# EAGLE design medium_h222 (EAGLE 5.07)
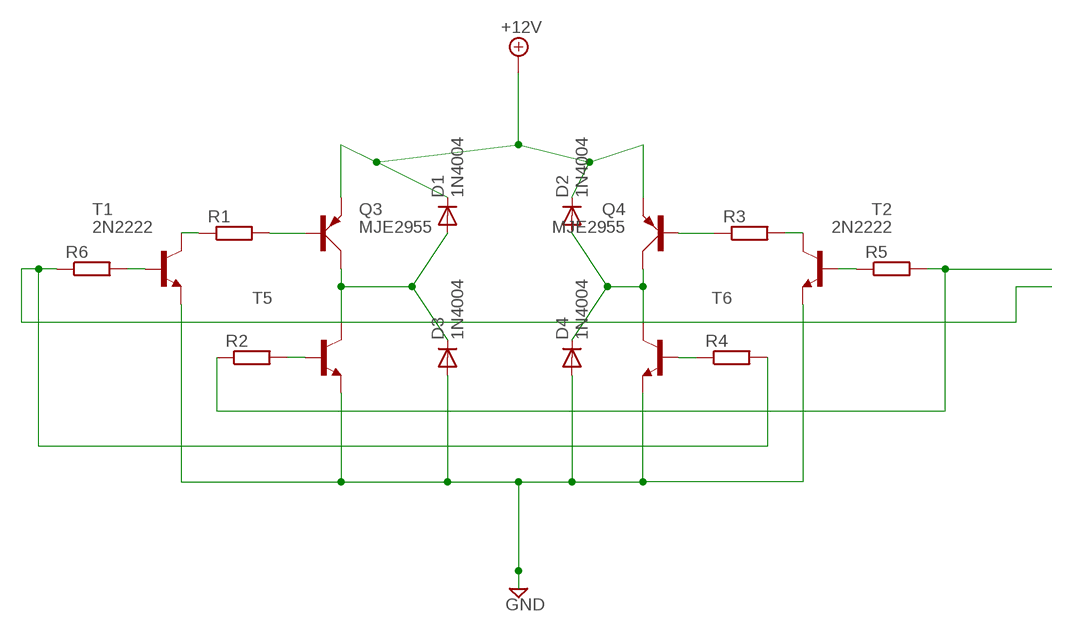
[diagram p0: schematic, sheet 1]

## Parts
D1  1N4004  [DO41-10]
D2  1N4004  [DO41-10]
D3  1N4004  [DO41-10]
D4  1N4004  [DO41-10]
Q3  MJE2955  [TO220AV]
Q4  MJE2955  [TO220AV]
R1  R-EU_0204/7  [0204/7]
R2  R-EU_0204/7  [0204/7]
R3  R-EU_0204/7  [0204/7]
R4  R-EU_0204/7  [0204/7]
R5  R-EU_0204/7  [0204/7]
R6  R-EU_0204/7  [0204/7]
T1  2N2222  [TO18]
T2  2N2222  [TO18]
T5  -NPN-TO220V  [TO220V]
T6  -NPN-TO220V  [TO220V]

## Nets
+12V: D1.C D2.C Q3.E Q4.E
GND: D3.A D4.A T1.1(E) T2.1(E) T5.3(E) T6.3(E)
N$1: R1.1 T1.3(C)
N$2: Q3.B R1.2
N$3: D2.A D4.C Q4.C T6.2(C)
N$6: R4.2 R6.1
N$7: R4.1 T6.1(B)
N$8: Q4.B R3.1
N$9: R2.2 T5.1(B)
N$10: R6.2 T1.2(B)
N$11: R5.1 T2.2(B)
N$12: R3.2 T2.3(C)
N$13: D1.A D3.C Q3.C T5.2(C)
N$15: R2.1 R5.2

## Library data of the parts
D1-D4 = diode:1N4004: DIODE general purpose rectifier, 1 A
Q3 Q4 = transistor-power:MJE2955: PNP TRANSISTOR
R1-R6 = resistor:R-EU_: RESISTOR, European symbol
T1 T2 = transistor:2N2222: NPN TRANSISTOR
T5 T6 = transistor-neu-to92:*-NPN-: NPN Transistror

## Board
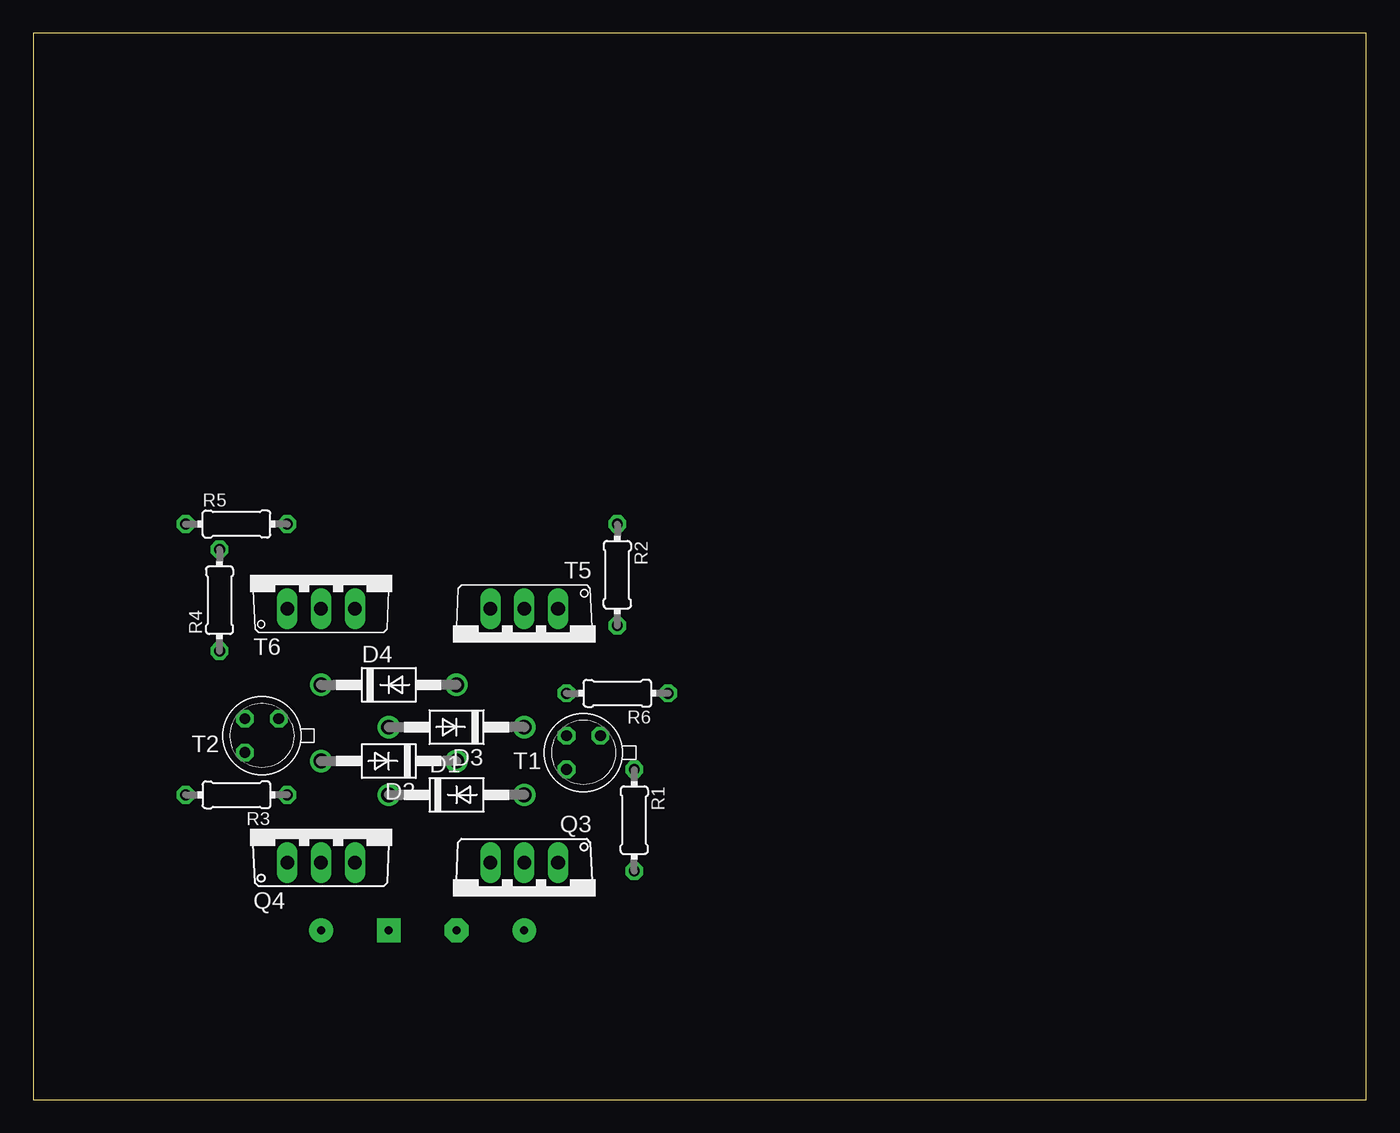
[diagram p1: board, top side]
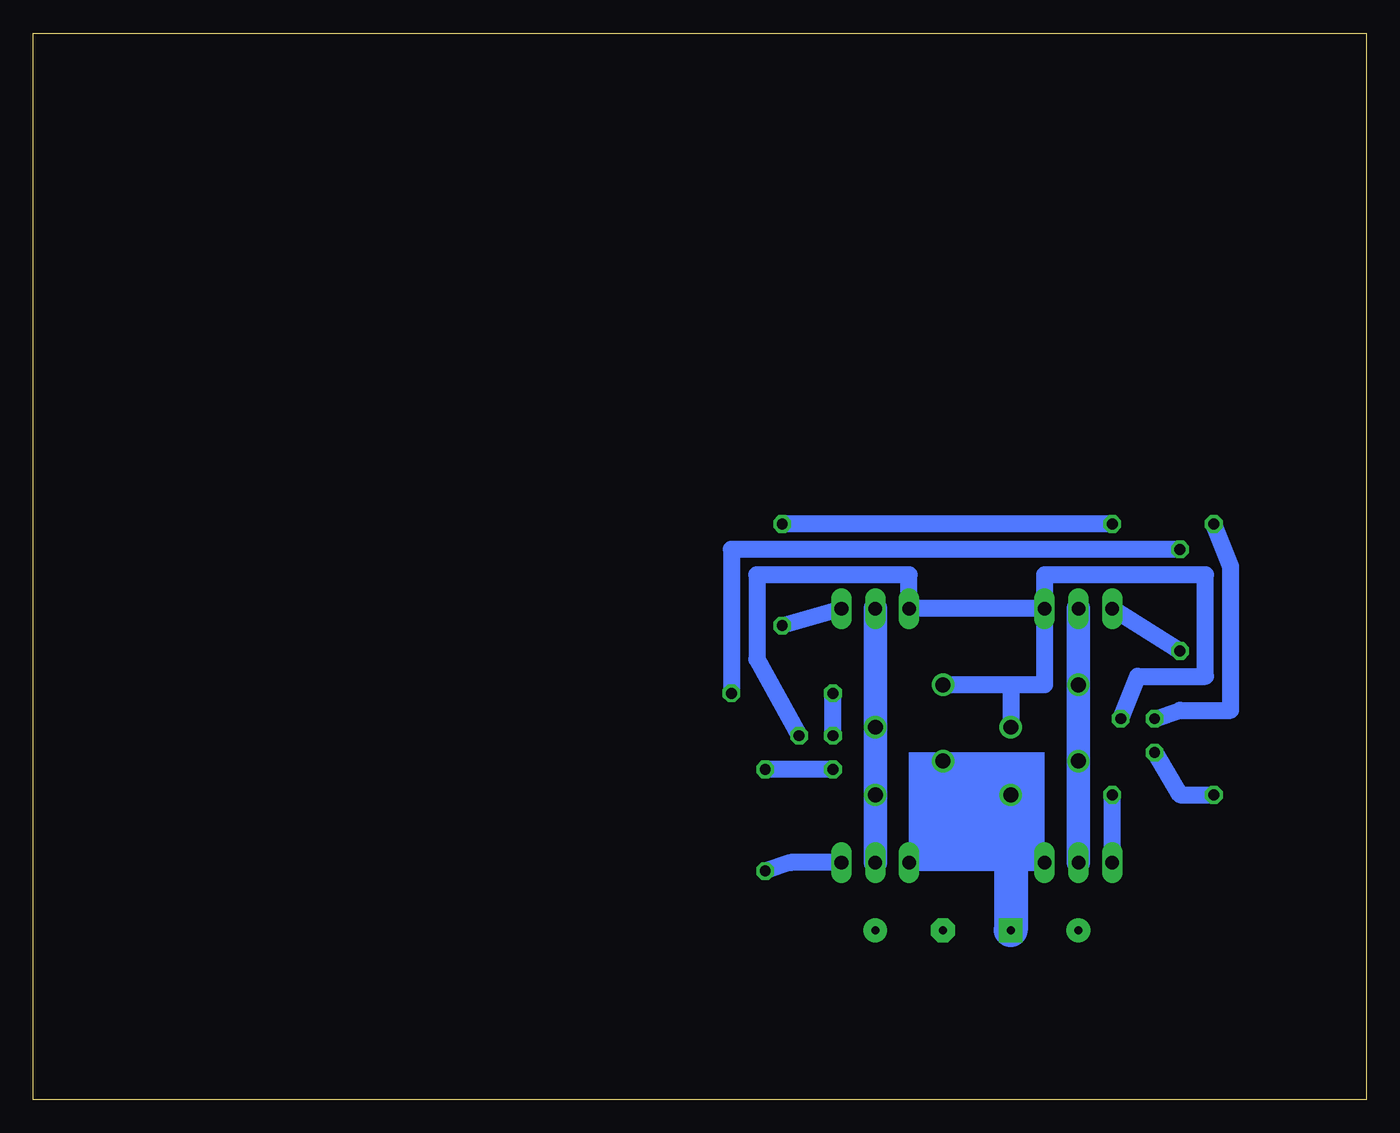
[diagram p2: board, bottom side, seen from below]

Size 100 x 80 mm. Coordinates in mm from the lower left corner, seen from the top.
Outline: 0,0 100,0 100,80 0,80 0,0
Copper layers (1*16): Top 0.035mm / dielectric 1.5mm / Bottom 0.035mm
Design rules "default": minimum track width 10mil, minimum drill 24mil, track to track 8mil, track to pad 8mil, pad to pad 8mil, via to via 8mil, smd to smd 8mil, copper to edge 40mil, drill to drill 8mil, minimum pad ring 10mil, minimum via ring 8mil, stop-mask expansion 4mil, vias tented up to drill 0mil, thermal gap 10mil

### Footprints (pad centres in the part's own frame; a part is rotated, then mirrored left to right if it is on the bottom)
DO41-10 = drill 1.118 round: A 5.08,0; C -5.08,0
TO220AV = drill 1.016 long: B -2.54,-2.54; C 0,-2.54; E 2.54,-2.54
0204/7 = drill 0.813 octagon: 1 -3.81,0; 2 3.81,0
TO18 = drill 0.813 octagon: 1 -1.27,-1.27; 2 1.27,-1.27; 3 1.27,1.27
TO220V = drill 1.016 long: 1 -2.54,-2.54; 2 0,-2.54; 3 2.54,-2.54

### Placement (x,y rotation side)
D1  31.75,22.86 0 top
D2  26.67,25.4 180 top
D3  31.75,27.94 180 top
D4  26.67,31.11 0 top
Q3  36.83,15.24 180 top
Q4  21.59,20.32 0 top
R1  45.09,20.95 270 top
R2  43.81,39.37 270 top
R3  15.24,22.86 180 top
R4  13.97,37.47 90 top
R5  15.24,43.18 0 top
R6  43.81,30.48 180 top
T1  41.27,26.04 180 top
T2  17.14,27.3 180 top
T5  36.83,34.29 180 top
T6  21.59,39.37 0 top

### Tracks (layer width: path | path; a pad name or v marks a point on that pad's centre or on a via)
+12V  (via drill 0.6 pad 1.78)
  Bottom 1.27: 27.94,17.78 Q3.E | Q4.E 26.67,17.78 27.94,17.78 | 27.94,17.78 D1.C D2.C
  Bottom 2.54: 26.67,17.78 v26.67,12.7
GND
  Bottom 1.27: T1.1 45.72,33.02 45.72,39.37 34.29,39.37 T5.3 T6.3 | T2.1 17.14,31.75 12.06,31.75 12.06,39.37 24.13,39.37 T6.3 | 26.67,31.11 D4.A | 26.67,31.11 24.13,31.11 T6.3 | 26.67,31.11 D3.A
N$1
  Bottom 1.27: T1.3 R1.1
N$2
  Bottom 1.27: Q3.B 43.18,17.78 R1.2
N$3
  Bottom 1.778: Q4.C D2.A | D2.A T6.2 | D2.A D4.C
N$4  (via drill 0.6 pad 1.78)
  other vias: 21.59,12.7
N$5  (via drill 0.6 pad 1.78)
  other vias: 36.83,12.7
N$6
  Bottom 1.27: R6.1 47.62,41.27 R4.2
N$7
  Bottom 1.27: R4.1 T6.1
N$8
  Bottom 1.27: Q4.B R3.1
N$9
  Bottom 1.27: R2.2 T5.1
N$10
  Bottom 1.27: T1.2 R6.2
N$11
  Bottom 1.27: T2.2 13.97,29.21 10.16,29.21 10.16,40.01 R5.1
N$12
  Bottom 1.27: T2.3 13.97,22.86 R3.2
N$13
  Bottom 1.778: Q3.C D1.A D3.C T5.2
N$15
  Bottom 1.27: R5.2 R2.1
N$16  (via drill 0.6 pad 1.78)
  other vias: 31.75,12.7
(copper drawn outside any net)
  shapes: Bottom area x1